# Altium schematic sheet led_em_kian_220v_v2_CONRCTOR.SchDoc
size A
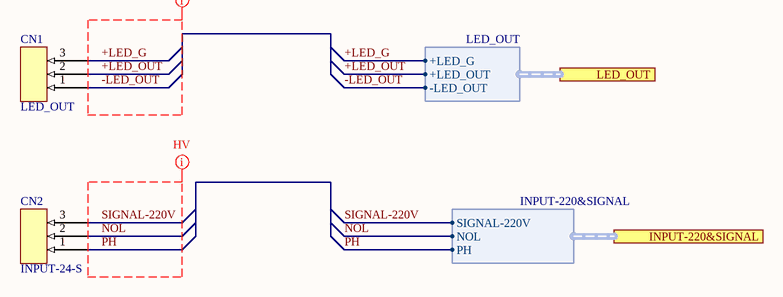
[diagram p0: led_em_kian_220v_v2_CONRCTOR.SchDoc]

## Parts
CN1  LED_OUT  [CONECTOR/FONIX/3PIN]
CN2  INPUT-24-S  [CONECTOR/FONIX/3PIN]

## Ports
INPUT-220&SIGNAL (harness INPUT-220&SIGNAL), LED_OUT (harness LED_OUT)

## Harnesses
LED_OUT: +LED_G, +LED_OUT, -LED_OUT
INPUT-220&SIGNAL: SIGNAL-220V, NOL, PH

## Nets
+LED_G: CN1.3 ; port LED_OUT.+LED_G
+LED_OUT: CN1.2 ; port LED_OUT.+LED_OUT
-LED_OUT: CN1.1 ; port LED_OUT.-LED_OUT
NOL: CN2.2 ; port INPUT-220&SIGNAL.NOL
PH: CN2.1 ; port INPUT-220&SIGNAL.PH
SIGNAL-220V: CN2.3 ; port INPUT-220&SIGNAL.SIGNAL-220V

## Layout directives
net class HV: NOL, PH, SIGNAL-220V
net class POWER_OUT: +LED_G, +LED_OUT, -LED_OUT

## Library data of the parts
CN1 CN2 = CONECTOR/FONIX/3PIN